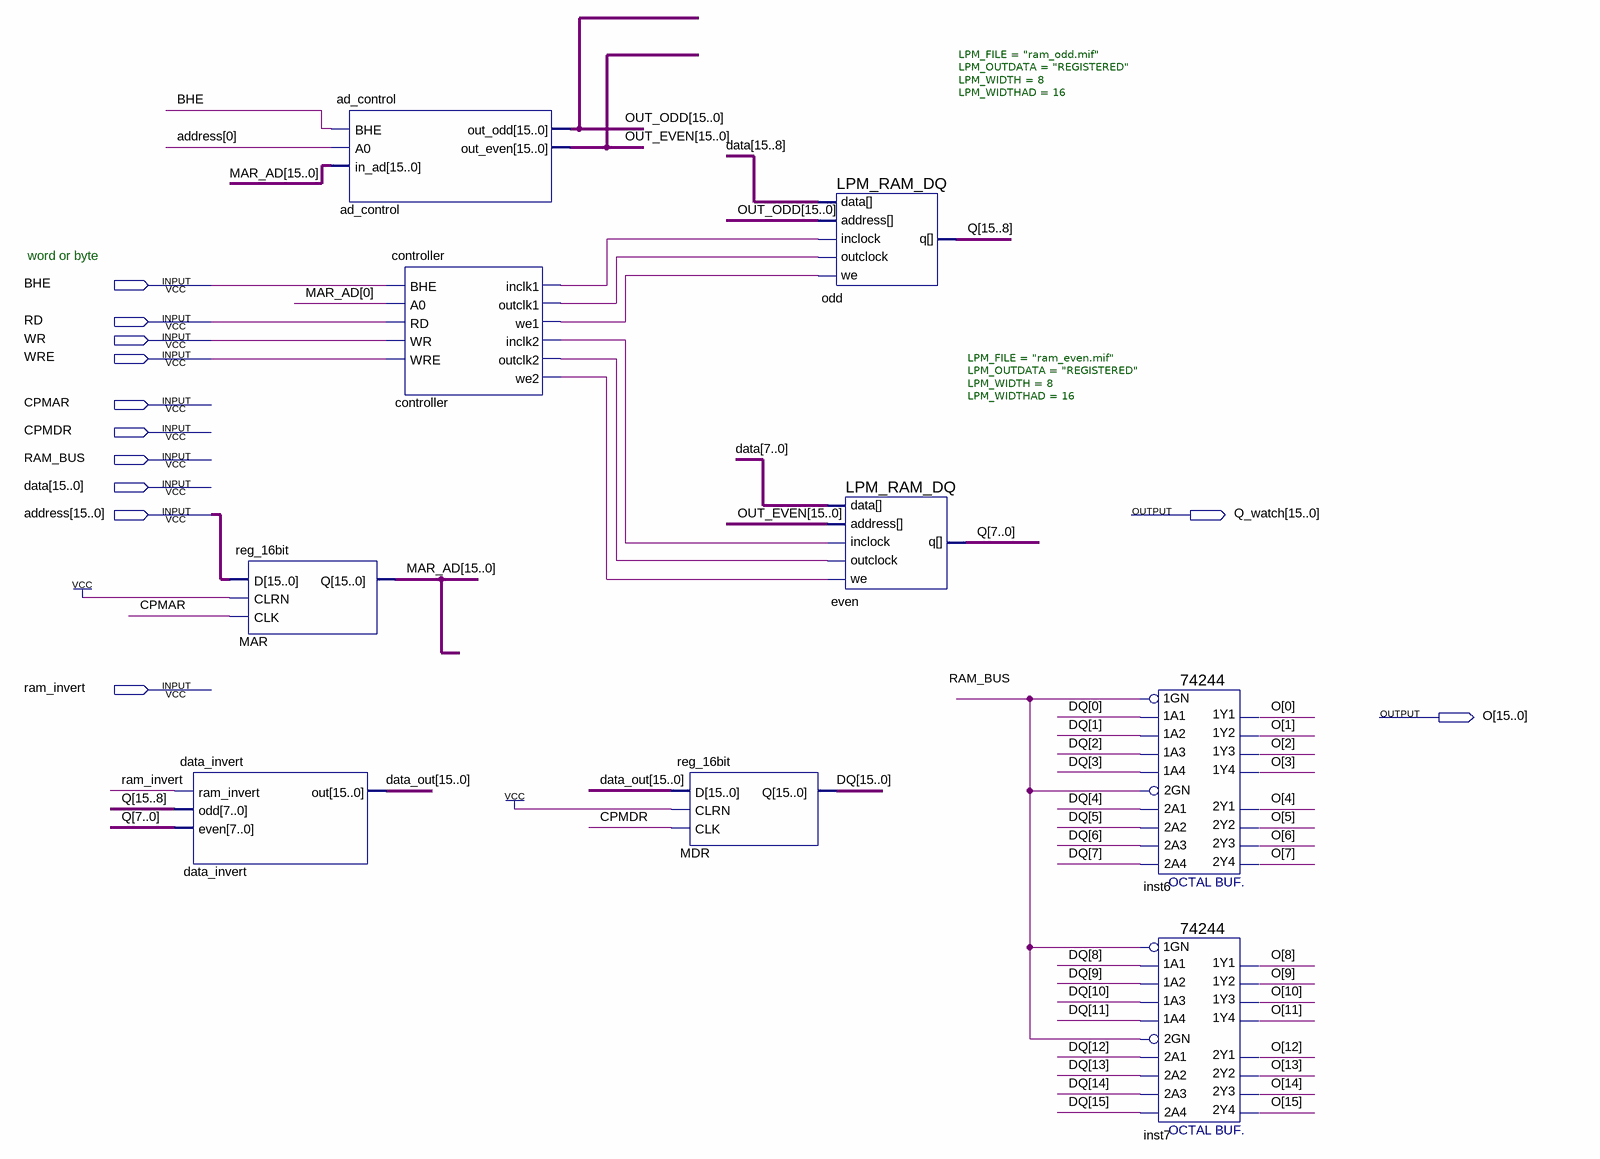
[diagram p0: schematic sheet]
// Quartus schematic ram.bdf as structural Verilog: 9 symbols, 12 pins
module ram (
  input  BHE,
  input  RD,
  input  WR,
  input  WRE,
  input  CPMAR,
  input  CPMDR,
  input  RAM_BUS,
  input  [15:0] data,
  input  [15:0] address,
  input  ram_invert,
  output [15:0] Q_watch,
  output [15:0] O
);

  wire controller_inclk1, controller_inclk2, controller_outclk1, controller_outclk2, controller_we1,
       controller_we2;
  wire [15:0] data_out, DQ, MAR_AD, OUT_EVEN, OUT_ODD, Q;

  reg_16bit MAR (.D(address), .CLRN(1'b1), .CLK(CPMAR), .Q(MAR_AD));
  data_invert data_invert (.ram_invert(ram_invert), .odd(Q[15:8]), .even(Q[7:0]), .out(data_out));
  ad_control ad_control (.BHE(BHE), .A0(address[0]), .in_ad(MAR_AD), .out_odd(OUT_ODD), .out_even(OUT_EVEN));
  controller controller (
    .BHE(BHE), .A0(MAR_AD[0]), .RD(RD), .WR(WR), .WRE(WRE), .inclk1(controller_inclk1),
    .outclk1(controller_outclk1), .we1(controller_we1), .inclk2(controller_inclk2),
    .outclk2(controller_outclk2), .we2(controller_we2));
  reg_16bit MDR (.D(data_out), .CLRN(1'b1), .CLK(CPMDR), .Q(DQ));
  LPM_RAM_DQ #(.LPM_FILE("ram_odd.mif"), .LPM_OUTDATA("REGISTERED"), .LPM_WIDTH(8), .LPM_WIDTHAD(16)) odd (
    .inclock(controller_inclk1), .data(data[15:8]), .address(OUT_ODD), .we(controller_we1),
    .outclock(controller_outclk1), .q(Q[15:8]));
  LPM_RAM_DQ #(.LPM_FILE("ram_even.mif"), .LPM_OUTDATA("REGISTERED"), .LPM_WIDTH(8), .LPM_WIDTHAD(16)) even (
    .inclock(controller_inclk2), .data(data[7:0]), .address(OUT_EVEN), .we(controller_we2),
    .outclock(controller_outclk2), .q(Q[7:0]));
  \74244  inst6 (
    .\1A2 (DQ[1]), .\1A4 (DQ[3]), .\1A1 (DQ[0]), .\1A3 (DQ[2]), .\1GN (RAM_BUS), .\2A3 (DQ[6]),
    .\2GN (RAM_BUS), .\2A1 (DQ[4]), .\2A4 (DQ[7]), .\2A2 (DQ[5]), .\1Y2 (O[1]), .\1Y4 (O[3]), .\2Y1 (O[4]),
    .\1Y1 (O[0]), .\2Y3 (O[6]), .\2Y4 (O[7]), .\1Y3 (O[2]), .\2Y2 (O[5]));
  \74244  inst7 (
    .\1A2 (DQ[9]), .\1A4 (DQ[11]), .\1A1 (DQ[8]), .\1A3 (DQ[10]), .\1GN (RAM_BUS), .\2A3 (DQ[14]),
    .\2GN (RAM_BUS), .\2A1 (DQ[12]), .\2A4 (DQ[15]), .\2A2 (DQ[13]), .\1Y2 (O[9]), .\1Y4 (O[11]),
    .\2Y1 (O[12]), .\1Y1 (O[8]), .\2Y3 (O[14]), .\2Y4 (O[15]), .\1Y3 (O[10]), .\2Y2 (O[13]));

  // Notes on the sheet:
  //   word or byte
endmodule
